# EAGLE design encoder (EAGLE 8.1.1)
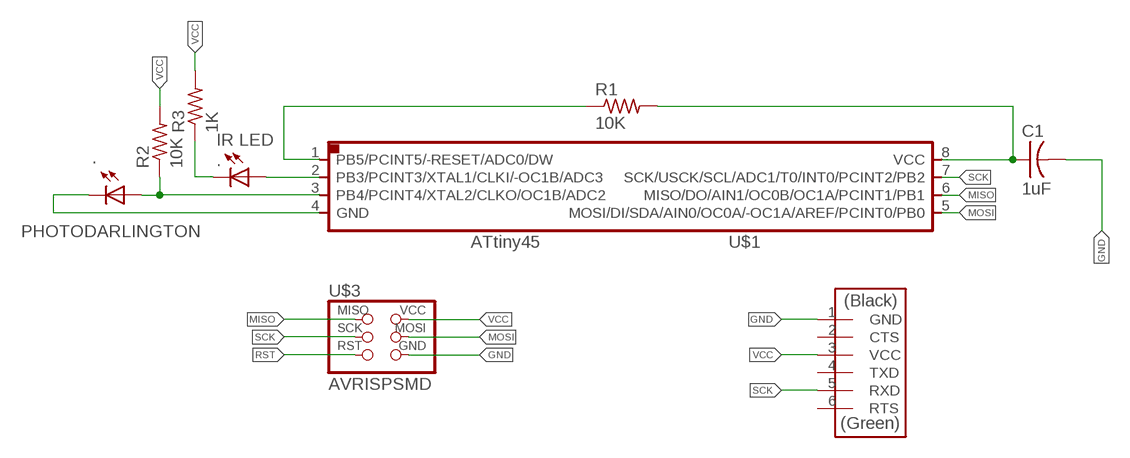
[diagram p0: schematic, sheet 1]

## Parts
.  IR LED  LEDFAB1206  [LED1206FAB]
C1  1uF  CAP-US1206FAB  [C1206FAB]
FTDI  FTDI-SMD-HEADER  [1X06SMD]
PHOTODARLINGTON  .  LED  [LED1206]
R1  10K  RES-US1206FAB  [R1206FAB]
R2  10K  RES-US1206FAB  [R1206FAB]
R3  1K  RES-US1206FAB  [R1206FAB]
U$1  ATTINY45SI  [SOIC8]
U$3  AVRISPSMD  [2X03SMD]

## Nets
GND: C1.2 FTDI.1(GND) PHOTODARLINGTON.2(C) U$1.4(GND) U$3.6(GND)
MISO: U$1.6(MISO/DO/AIN1/OC0B/OC1A/PCINT1/PB1) U$3.1(MISO)
MOSI: U$1.5(MOSI/DI/SDA/AIN0/OC0A/-OC1A/AREF/PCINT0/PB0) U$3.4(MOSI)
N$1: ..1(A) U$1.2(PB3/PCINT3/XTAL1/CLKI/-OC1B/ADC3)
N$3: ..2(C) R3.1
R2: PHOTODARLINGTON.1(A) R2.1 U$1.3(PB4/PCINT4/XTAL2/CLKO/OC1B/ADC2)
RST: R1.1 U$1.1(PB5/PCINT5/-RESET/ADC0/DW) U$3.5(RST)
SCK: FTDI.5(RXD) U$1.7(SCK/USCK/SCL/ADC1/T0/INT0/PCINT2/PB2) U$3.3(SCK)
VCC: C1.1 FTDI.3(VCC) R1.2 R2.2 R3.2 U$1.8(VCC) U$3.2(VCC)
Unconnected: FTDI.2(CTS) FTDI.4(TXD) FTDI.6(RTS)

## Library data of the parts
. PHOTODARLINGTON = fab:LED: LED
C1 = fab:CAP-US
FTDI = fab:FTDI-SMD-HEADER
R1-R3 = fab:RES-US: Resistor (US Symbol) Variants with postfix FAB are widened to allow the routing of internal traces
U$1 = fab:ATTINY45
U$3 = fab:AVRISP

## Board
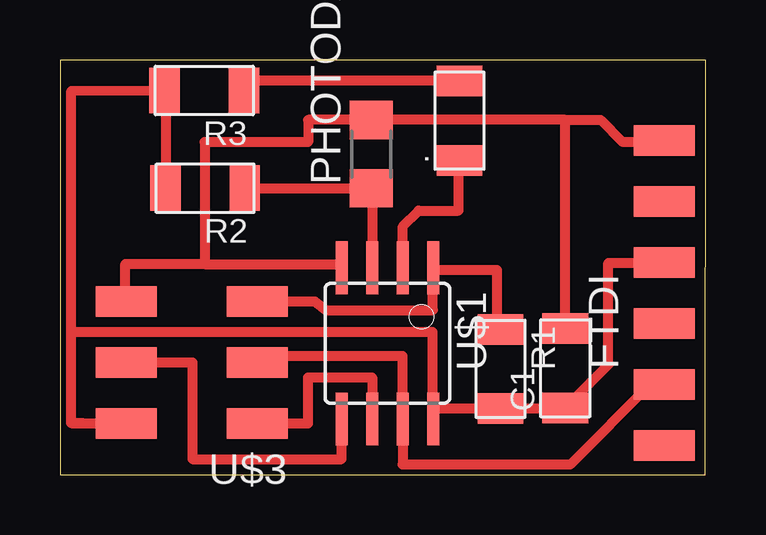
[diagram p1: board, top side]

Size 26.91 x 17.28 mm. Coordinates in mm from the lower left corner, seen from the top.
Outline: 0,0 26.89,0 26.91,17.28 0.01,17.28 0,0
Copper layers (1*16): Top 0.035mm / dielectric 1.5mm / Bottom 0.035mm
Design rules "default": minimum track width 10mil, minimum drill 24mil, track to track 8mil, track to pad 8mil, pad to pad 8mil, via to via 8mil, smd to smd 8mil, copper to edge 40mil, drill to drill 8mil, minimum pad ring 10mil, minimum via ring 8mil, stop-mask expansion 4mil, vias tented up to drill 0mil, thermal gap 10mil

### Footprints (pad centres in the part's own frame; a part is rotated, then mirrored left to right if it is on the bottom)
LED1206FAB = smd 1.27 x 1.905: 1 -1.651,0; 2 1.651,0
C1206FAB = smd 1.27 x 1.905: 1 -1.651,0; 2 1.651,0
1X06SMD = smd 2.54 x 1.27: 1 0,6.35; 2 0,3.81; 3 0,1.27; 4 0,-1.27; 5 0,-3.81; 6 0,-6.35
LED1206 = smd 1.6 x 1.803: 1 -1.422,0; 2 1.422,0
R1206FAB = smd 1.27 x 1.905: 1 -1.651,0; 2 1.651,0
SOIC8 = smd 0.5 x 2.2: 1 -1.905,-3.154; 2 -0.645,-3.154; 3 0.625,-3.154; 4 1.895,-3.154; 5 1.905,3.154; 6 0.635,3.154; 7 -0.635,3.154; 8 -1.905,3.154
2X03SMD = smd 2.54 x 1.27: 1 -2.54,2.54; 2 2.92,2.54; 3 -2.54,0; 4 2.92,0; 5 -2.54,-2.54; 6 2.92,-2.54

### Placement (x,y rotation side)
.  16.64,14.75 90 top
C1  21.05,4.43 90 top
FTDI  25.19,7.57 0 top
PHOTODARLINGTON  12.97,13.36 90 top
R1  18.35,4.41 270 top
R2  6.05,11.94 180 top
R3  6.01,16.01 180 top
U$1  13.64,5.47 180 top
U$3  5.68,4.68 180 top

### Tracks (layer width: path | path; a pad name or v marks a point on that pad's centre or on a via)
GND
  Top 0.406: 11.75,8.93 U$1.4 11.75,8.77 6.02,8.77 | C1.2 21.05,14.78 | 21.05,14.78 PHOTODARLINGTON.2 10.34,14.78 10.34,13.85 6.02,13.85 6.02,8.77 | 21.05,14.78 22.52,14.78 23.42,13.88 25.15,13.88 FTDI.1 | U$3.6 2.72,7.22 2.72,8.77 6.02,8.77
MISO
  Top 0.406: U$3.1 10.34,2.14 10.34,4.06 13.01,4.06 U$1.6
MOSI
  Top 0.406: 11.74,1.31 U$1.5 11.74,0.65 5.51,0.65 5.51,4.68 U$3.4
N$1
  Top 0.406: ..1 16.6,13.1 16.6,11.01 14.95,11.01 14.29,10.35 U$1.2
N$3
  Top 0.406: ..2 16.75,16.4 16.55,16.42 7.48,16.42 R3.1
R2
  Top 0.406: U$1.3 13.02,11.94 PHOTODARLINGTON.1 R2.1
RST
  Top 0.406: R1.1 18.21,6.06 18.21,8.52 15.55,8.52 U$1.1 15.54,6.85 11.09,6.85 10.62,7.22 U$3.5
SCK
  Top 0.406: FTDI.5 24.6,3.76 21.26,0.42 14.28,0.42 U$1.7 14.28,4.94 8.22,4.94 U$3.3
VCC
  Top 0.406: R2.2 4.4,15.22 R3.2 0.47,16 0.47,5.98 0.46,5.98 0.46,5.94 | FTDI.3 25.19,8.83 22.85,8.83 22.85,4.58 C1.1 21.05,2.76 R1.2 15.55,2.76 U$1.8 15.53,2.32 15.53,5.94 0.46,5.94 | 0.46,2.14 0.94,2.14 | 0.94,2.14 U$3.2 | 0.94,2.14 0.46,2.14 0.46,5.94